# EAGLE schematic 20160901_MMPLATES (EAGLE 7.4.0)
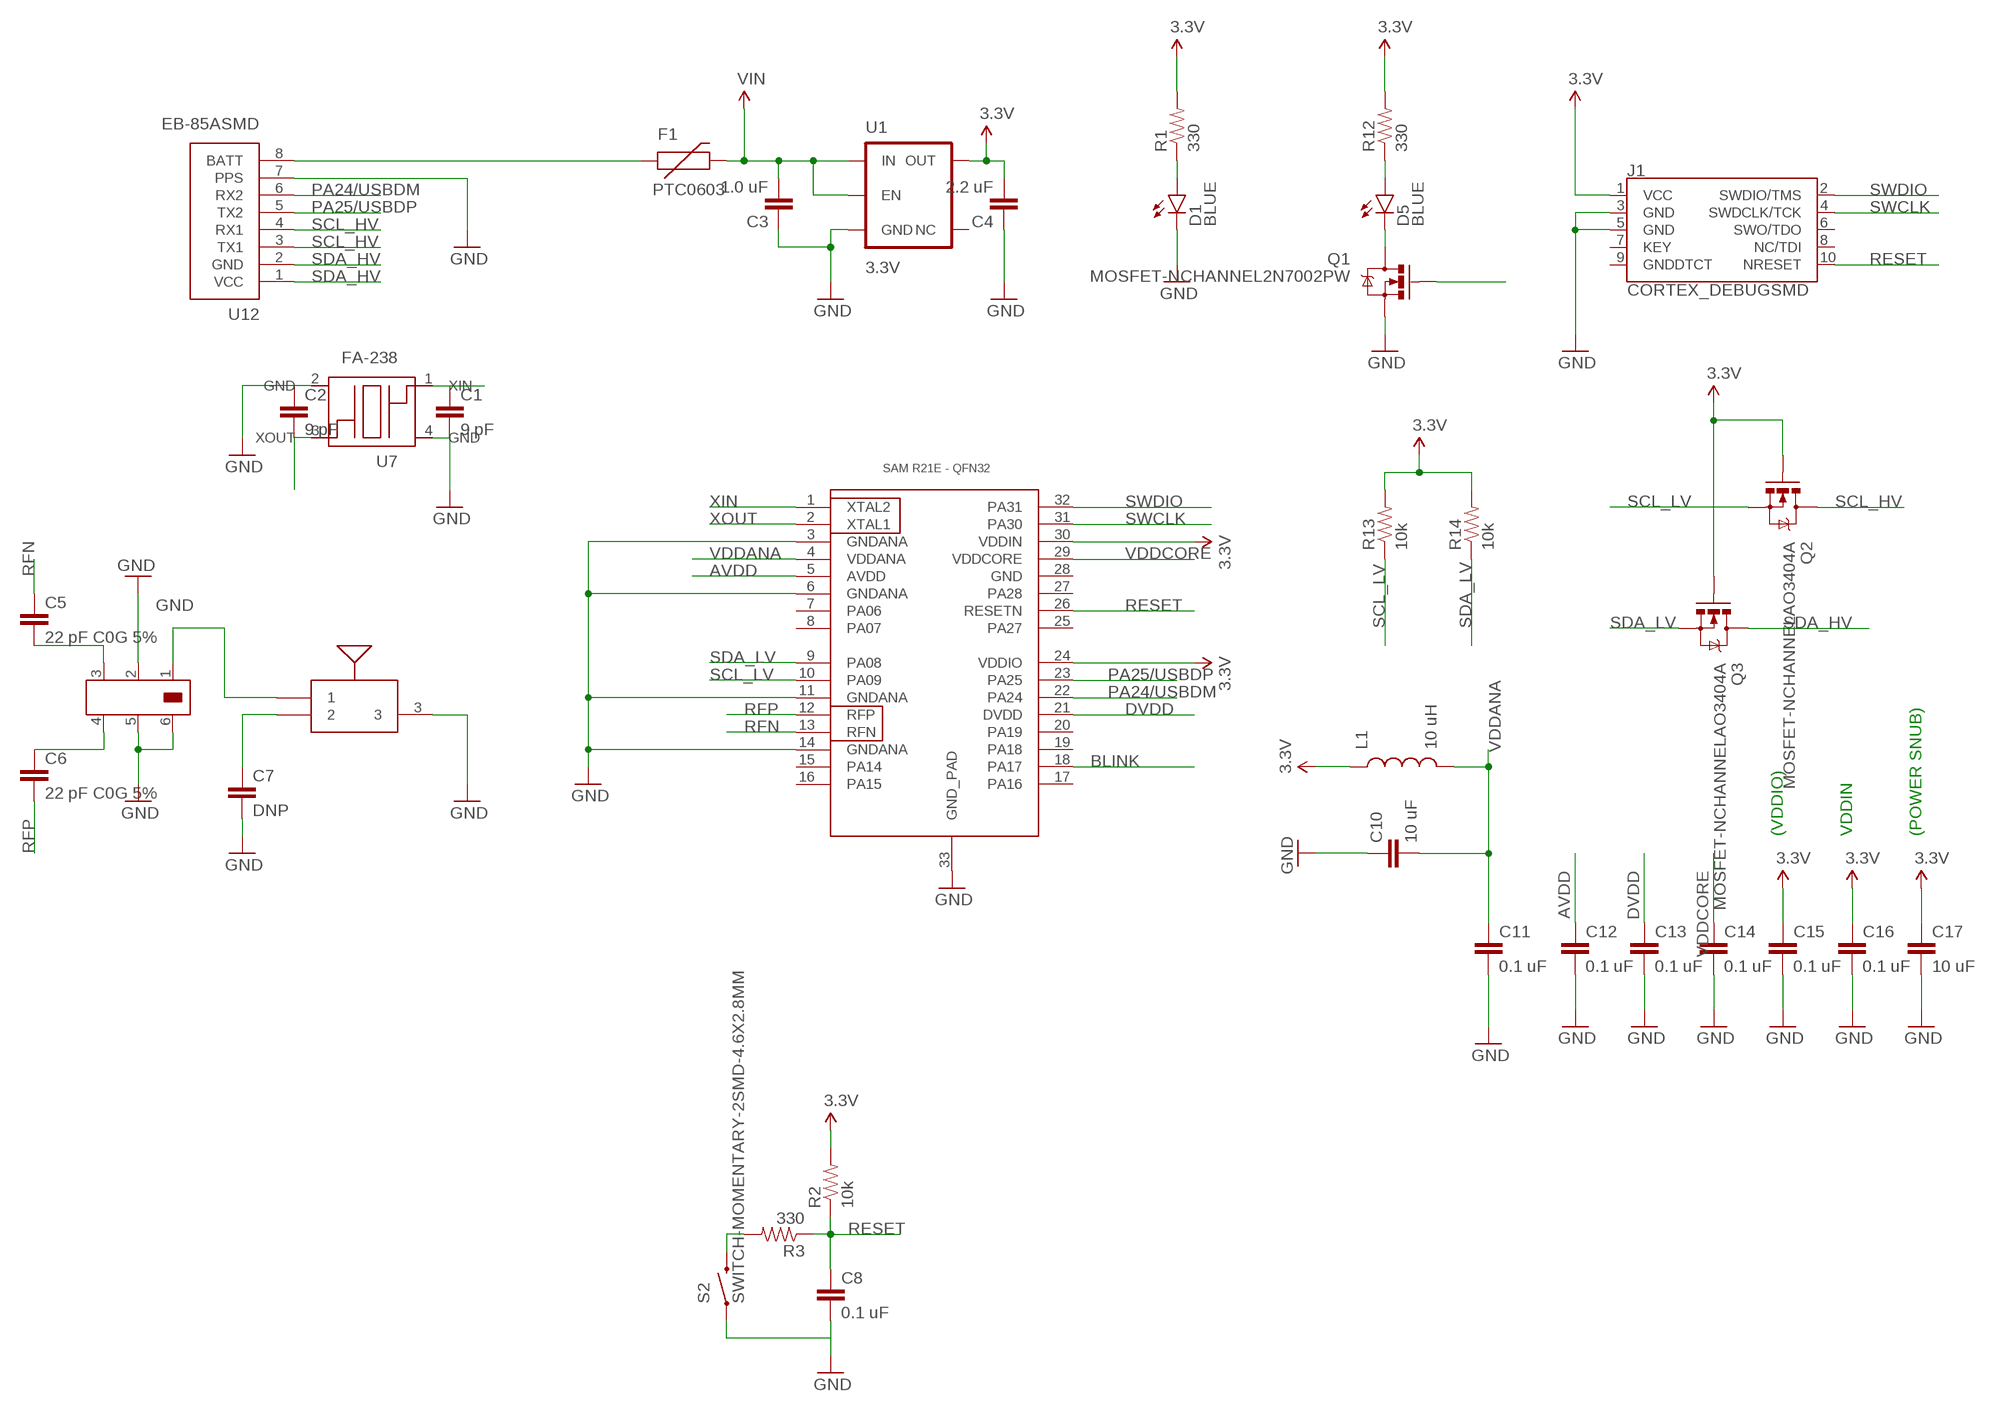
[diagram p0: schematic, sheet 1, part 1 of 2]
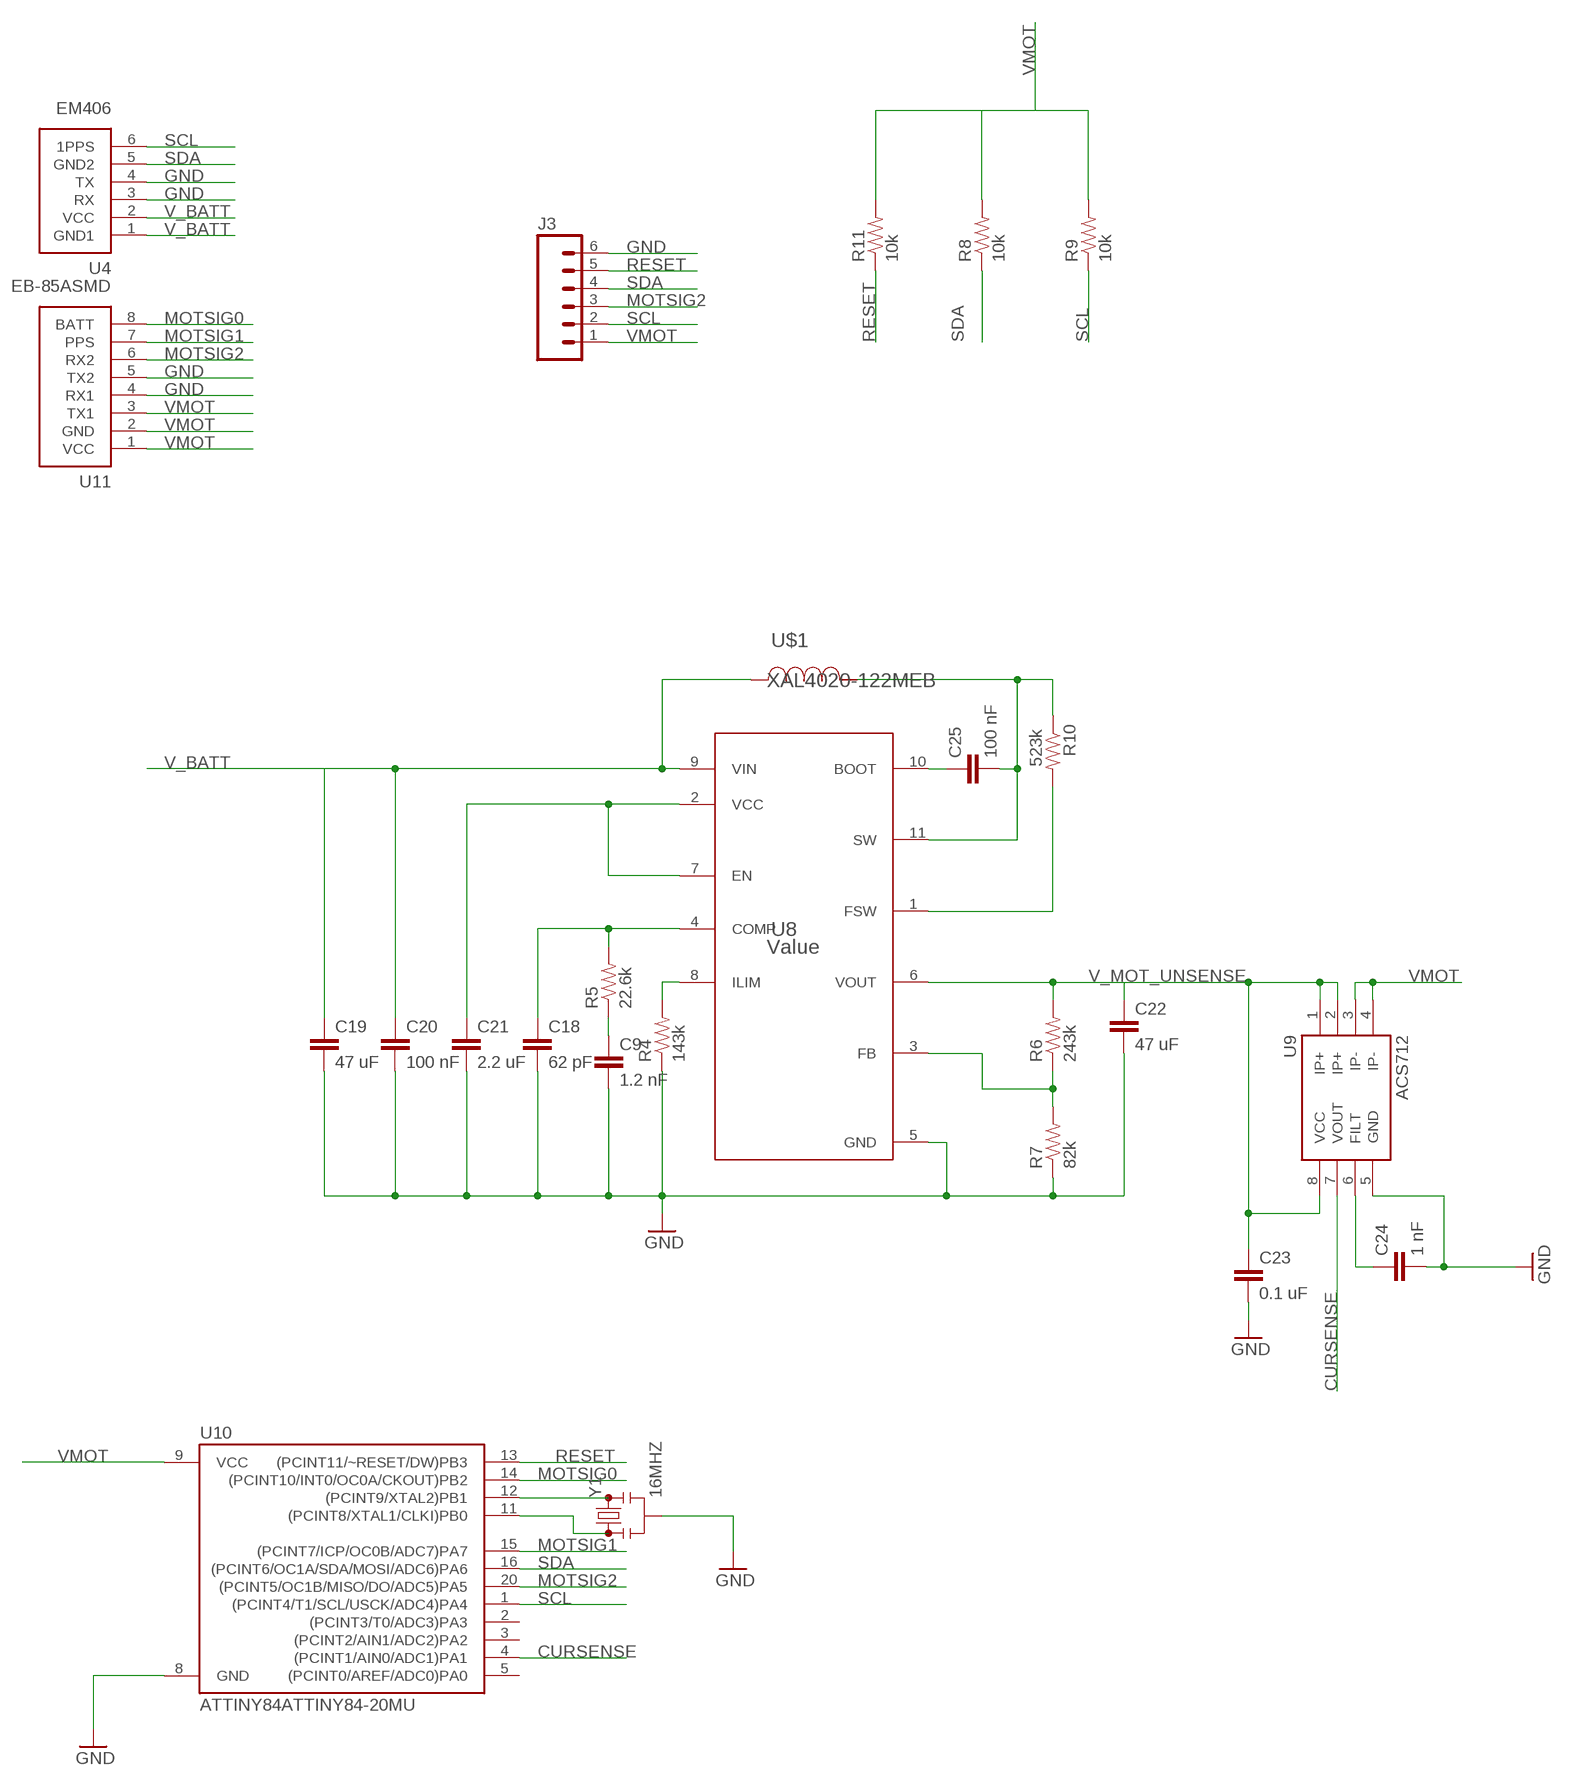
[diagram p1: schematic, sheet 1, part 2 of 2]

## Parts
C1  9 pF  CAP0402-CAP  [0402-CAP]
C2  9 pF  CAP0402-CAP  [0402-CAP]
C3  1.0 uF  CAP0402-CAP  [0402-CAP]
C4  2.2 uF  CAP0402-CAP  [0402-CAP]
C5  22 pF C0G 5%  CAP0402-CAP  [0402-CAP]
C6  22 pF C0G 5%  CAP0402-CAP  [0402-CAP]
C7  DNP  CAP0402-CAP  [0402-CAP]
C8  0.1 uF  CAP0402-CAP  [0402-CAP]
C9  1.2 nF  CAP0805  [0805]
C10  10 uF  CAP0402-CAP  [0402-CAP]
C11  0.1 uF  CAP0402-CAP  [0402-CAP]
C12  0.1 uF  CAP0402-CAP  [0402-CAP]
C13  0.1 uF  CAP0402-CAP  [0402-CAP]
C14  0.1 uF  CAP0402-CAP  [0402-CAP]
C15  0.1 uF  CAP0402-CAP  [0402-CAP]
C16  0.1 uF  CAP0402-CAP  [0402-CAP]
C17  10 uF  CAP0402-CAP  [0402-CAP]
C18  62 pF  CAP0805  [0805]
C19  47 uF  CAP1206  [1206]
C20  100 nF  CAP0402-CAP  [0402-CAP]
C21  2.2 uF  CAP0603-CAP  [0603-CAP]
C22  47 uF  CAP1206  [1206]
C23  0.1 uF  CAP0402-CAP  [0402-CAP]
C24  1 nF  CAP0402-CAP  [0402-CAP]
C25  100 nF  CAP0402-CAP  [0402-CAP]
D1  BLUE  LED-BLUE0603  [LED-0603]
D5  BLUE  LED-BLUE0603  [LED-0603]
F1  PTC0603  [0603]
J1  CORTEX_DEBUGSMD  [SAMTECH_FTSH-105-01]
J3  M06SMD-1MM  [1X06-1MM]
L1  10 uH  INDUCTOR0603  [0603]
Q1  MOSFET-NCHANNEL2N7002PW  [SOT323]
Q2  MOSFET-NCHANNELAO3404A  [SOT23-3]
Q3  MOSFET-NCHANNELAO3404A  [SOT23-3]
R1  330  RESISTOR0402-RES  [0402-RES]
R2  10k  RESISTOR0402-RES  [0402-RES]
R3  330  RESISTOR0402-RES  [0402-RES]
R4  143k  RESISTOR1206  [1206]
R5  22.6k  RESISTOR0402-RES  [0402-RES]
R6  243k  RESISTOR0402-RES  [0402-RES]
R7  82k  RESISTOR0603-RES  [0603-RES]
R8  10k  RESISTOR0402-RES  [0402-RES]
R9  10k  RESISTOR0402-RES  [0402-RES]
R10  523k  RESISTOR1206  [1206]
R11  10k  RESISTOR0402-RES  [0402-RES]
R12  330  RESISTOR0402-RES  [0402-RES]
R13  10k  RESISTOR0402-RES  [0402-RES]
R14  10k  RESISTOR0402-RES  [0402-RES]
S2  SWITCH-MOMENTARY-2SMD-4.6X2.8MM  [TACTILE_SWITCH_SMD_4.6X2.8MM]
U1  3.3V  V_REG_AP2112K-3.3V  [SOT23-5]
U2  ATSAMR21E18A-MUT  [QFN32]
U4  EM406  [EM406]
U5  PULSE_ANT_2.4GHZ  [ANT_BAR]
U6  JOHANSON_2450BM15A0015E  [0805_BALUN]
U7  FA-238  [FA-238]
U8  Value  TPS61089RNRR  [RNR0011A]
U9  ACS712  [SO08]
U10  ATTINY84ATTINY84-20MU  [QFN20]
U11  EB-85ASMD  [EB-85A]
U12  EB-85ASMD  [EB-85A]
U$1  XAL4020-122MEB  [XAL4020]
Y1  16MHZ  RESONATOR16MHZ  [RESONATOR-SMD]

## Nets
3.3V: C4.2 C15.1 C16.1 C17.1 J1.1(VCC) L1.1 Q2.1(G) Q3.1(G) R1.2 R2.2 R12.2 R13.2 R14.2 U1.5(OUT) U2.24(VDDIO) U2.30(VDDIN)
AVDD: C12.1 U2.5(AVDD)
BLINK: Q1.1(G) U2.18(PA17)
CURSENSE: U9.7(VOUT) U10.4((PCINT1/AIN0/ADC1)PA1)
DVDD: C13.1 U2.21(DVDD)
GND: C1.2 C2.1 C3.1 C4.1 C7.2 C8.2 C9.2 C10.1 C11.2 C12.2 C13.2 C14.2 C15.2 C16.2 C17.2 C18.2 C19.2 C20.2 C21.2 C22.2 C23.2 C24.2 D1.C J1.3(GND) J1.5(GND) J3.6 Q1.2(S) R4.1 R7.1 S2.1 S2.2 U1.2(GND) U2.3(GNDANA) U2.6(GNDANA) U2.11(GNDANA) U2.14(GNDANA) U2.33(GND_PAD) U4.3(RX) U4.4(TX) U5.3 U6.2 U6.5 U6.6 U7.2(GND) U7.4(GND) U8.5(GND) U9.5(GND) U10.8(GND) U11.4(RX1) U11.5(TX2) U12.7(PPS) Y1.2
MOTSIG0: U10.14((PCINT10/INT0/OC0A/CKOUT)PB2) U11.8(BATT)
MOTSIG1: U10.15((PCINT7/ICP/OC0B/ADC7)PA7) U11.7(PPS)
MOTSIG2: J3.3 U10.20((PCINT5/OC1B/MISO/DO/ADC5)PA5) U11.6(RX2)
N$1: F1.1 U12.8(BATT)
N$2: R3.2 S2.3 S2.4
N$3: R4.2 U8.8(ILIM)
N$4: U10.12((PCINT9/XTAL2)PB1) Y1.3
N$5: U10.11((PCINT8/XTAL1/CLKI)PB0) Y1.1
N$6: U5.1 U6.1
N$7: C7.1 U5.2
N$8: D1.A R1.1
N$10: C5.2 U6.3
N$11: C6.1 U6.4
N$14: C9.1 R5.1
N$15: C18.1 R5.2 U8.4(COMP)
N$16: C24.1 U9.6(FILT)
N$19: C21.1 U8.2(VCC) U8.7(EN)
N$20: D5.A R12.1
N$21: D5.C Q1.3(D)
N$27: C25.1 U8.10(BOOT)
N$28: C25.2 R10.1 U8.11(SW) U$1.2
N$29: R10.2 U8.1(FSW)
N$31: R6.1 R7.2 U8.3(FB)
PA24/USBDM: U2.22(PA24) U12.6(RX2)
PA25/USBDP: U2.23(PA25) U12.5(TX2)
RESET: C8.1 J1.10(NRESET) J3.5 R2.1 R3.1 R11.1 U2.26(RESETN) U10.13((PCINT11/~RESET/DW)PB3)
RFN: C5.1 U2.13(RFN)
RFP: C6.2 U2.12(RFP)
SCL: J3.2 R9.1 U4.6(1PPS) U10.1((PCINT4/T1/SCL/USCK/ADC4)PA4)
SCL_HV: Q2.3(D) U12.3(TX1) U12.4(RX1)
SCL_LV: Q2.2(S) R13.1 U2.10(PA09)
SDA: J3.4 R8.1 U4.5(GND2) U10.16((PCINT6/OC1A/SDA/MOSI/ADC6)PA6)
SDA_HV: Q3.3(D) U12.1(VCC) U12.2(GND)
SDA_LV: Q3.2(S) R14.1 U2.9(PA08)
SWCLK: J1.4(SWDCLK/TCK) U2.31(PA30)
SWDIO: J1.2(SWDIO/TMS) U2.32(PA31)
V_BATT: C19.1 C20.1 U4.1(GND1) U4.2(VCC) U8.9(VIN) U$1.1
V_MOT_UNSENSE: C22.1 C23.1 R6.2 U8.6(VOUT) U9.1(IP+) U9.2(IP+) U9.8(VCC)
VDDANA: C10.2 C11.1 L1.2 U2.4(VDDANA)
VDDCORE: C14.1 U2.29(VDDCORE)
VIN: C3.2 F1.2 U1.1(IN) U1.3(EN)
VMOT: J3.1 R8.2 R9.2 R11.2 U9.3(IP-) U9.4(IP-) U10.9(VCC) U11.1(VCC) U11.2(GND) U11.3(TX1)
XIN: C1.1 U2.1(XTAL2) U7.1(XIN)
XOUT: C2.2 U2.2(XTAL1) U7.3(XOUT)
Unconnected: J1.6(SWO/TDO) J1.7(KEY) J1.8(NC/TDI) J1.9(GNDDTCT) U1.4(NC) U2.7(PA06) U2.8(PA07) U2.15(PA14) U2.16(PA15) U2.17(PA16) U2.19(PA18) U2.20(PA19) U2.25(PA27) U2.27(PA28) U2.28(GND) U10.2((PCINT3/T0/ADC3)PA3) U10.3((PCINT2/AIN1/ADC2)PA2) U10.5((PCINT0/AREF/ADC0)PA0)

## Notes on the sheet
- (VDDIO) | VDDIN | (POWER SNUB)

## Library data of the parts
C1-C25 = SparkFun-Passives:CAP: Capacitor Standard 0603 ceramic capacitor, and 0.1" leaded capacitor.
D1 D5 = SparkFun-LED:LED-BLUE: Blue LEDs for production use Various blue LEDs stocked by SparkFun production 0603 - DIO-08575 Rebel - DIO-09553 1206 - DIO-09911; PROD_ID: DIO-08575
F1 = SparkFun-PowerIC:PTC: Resettable Fuse PTC Resettable Fuse. Spark Fun Electronics SKU : COM-08357
J1 = SparkFun-Connectors:CORTEX_DEBUG: Cortex Debug Connector Datasheet <http://infocenter.arm.com/help/topic/com.arm.doc.faqs/attached/13634/cortex_debug_connectors.pdf>
J3 = CSL_Components:M06: Header 6 Standard 6-pin 0.1" header. Use with straight break away headers (SKU : PRT-00116), right angle break away headers (PRT-00553), swiss pins (PRT-00743), machine pins (PRT-00117), and female headers (PRT-00115). Molex polarized connector foot print use with SKU : PRT-08094 with associated crimp pins and housings. NOTES ON THE VARIANTS LOCK and LOCK_LONGPADS... This footprint was designed to help hold the alignment of a through-hole component (i.e. 6-pin header) while soldering it into place. You may notice that each hole has been shifted either up or down by 0.005 of an inch from it's more standard position (which is a perfectly straight line). This slight alteration caused the pins (the squares in the middle) to touch the edges of the holes. Because they are alternating, it causes a "brace" to hold the component in place. 0.005 has proven to be the perfect amount of "off-center" position when using our standard breakaway headers. Although looks a little odd when you look at the bare footprint, once you have a header in there, the alteration is very hard to notice. Also,if you push a header all the way into place, it is covered up entirely on the bottom side. This idea of altering the position of holes to aid alignment will be further integrated into the Sparkfun Library for other footprints. It can help hold any component with 3 or more connection pins.
L1 = SparkFun-Passives:INDUCTOR: Inductors Basic Inductor/Choke - 0603 and 1206. Footprints are not proven and vary greatly between part numbers. INDUCTOR POWER 3.3UH 4.0A SMD 0.197" L x 0.197" W x 0.177" H (5.00mm x 5.00mm x 4.50mm)
Q1 = SparkFun-DiscreteSemi:MOSFET-NCHANNEL: Common NMOSFET Parts MFG P/N Store ID Prod ID FDD8780 TRANS-09984 SI7820DN TRANS-11055 FDS6630A IC-08089 2N7002PW TRANS-11151 FQP30N06L COM-10213 TRANS-10060 BSS123LT1G TRANS-08345 BSS138 TRANS-00830 BS170 2N7000; PROD_ID: TRANS-11151
Q2 Q3 = SparkFun-DiscreteSemi:MOSFET-NCHANNEL: Common NMOSFET Parts MFG P/N Store ID Prod ID FDD8780 TRANS-09984 SI7820DN TRANS-11055 FDS6630A IC-08089 2N7002PW TRANS-11151 FQP30N06L COM-10213 TRANS-10060 BSS123LT1G TRANS-08345 BSS138 TRANS-00830 BS170 2N7000; PROD_ID: TRAN-12988
R1-R3 R5-R9 R11-R14 = SparkFun-Passives:RESISTOR: Resistor Basic schematic elements and footprints for 0603, 1206, and PTH resistors.
R4 R10 = SparkFun-Resistors:RESISTOR: Resistor Basic schematic elements and footprints for 0603, 1206, and PTH resistors.
S2 = SparkFun-Electromechanical:SWITCH-MOMENTARY-2: Various NO switches- pushbuttons, reed, etc; PROD_ID: SWCH-13065
U1 = SparkFun-PowerIC:V_REG_AP2112: AP2112 - 600mA CMOS LDO Regulator w/ Enable The AP2112 is CMOS process low dropout linear regulator with enable function, the regulator delivers a guaranteed 600mA (min.) continuous load current. Features Output Voltage Accuracy: ±1.5% Output Current: 600mA (Min.) Foldback Short Current Protection: 50mA Enable Function to Turn ON/OFF VOUT Low Dropout Voltage (3.3V): 250mV (Typ.) @IOUT=600mA Excellent Load Regulation: 0.2%/A (Typ.) Excellent Line Regulation: 0.02%/V (Typ.) Low Quiescent Current: 55μA (Typ.) Low Standby Current: 0.01μA (Typ.) Low Output Noise: 50μVRMS PSRR: 100Hz -65dB, 1kHz -65dB OTSD Protection Stable with 1.0μF Flexible Cap: Ceramic, Tantalum and Aluminum Electrolytic Operation Temperature Range: -40°C to 85°C ESD: MM 400V, HBM 4000V; PROD_ID: VREG-12457
U2 = atmel-samr21:ATSAMR21E18A-MUT: This is the ATMEL SAMR21E QFN-32. ATSAMR21E18A
U4 = SparkFun-Connectors:EM406: EM406 GPS Connector Proven layout and schematic for EM406 connector. Spark Fun Electronics SKU : GPS-00579
U5 = bar_antenna:PULSE_ANT_2.4GHZ: Manufacturer part #W3008
U6 = balun:JOHANSON_2450BM15A0015E
U7 = crystals:FA-238
U8 = TPS61089RNRR_4.8V:TPS61089RNRR; MANUFACTURER: Texas Instruments; MANUFACTURER_NAME: Texas Instruments; MANUFACTURER_PART_NUMBER: TPS61089RNRR; PARTNUMBER: TPS61089RNRR; REFDES: RefDes; TYPE: TYPE
U9 = SparkFun-AnalogIC:ACS712: Hall-effect-based isolated linear current sensor; PROD_ID: IC-08964
U10 = SparkFun-DigitalIC:ATTINY84: Atmel 14-pin 2/4/8kB flash uC
U11 U12 = SparkFun-Connectors:EB-85A: EB-85A Connector Proven layout and schematic for ETek 5Hz GPS receiver connector. Spark Fun Electronics SKU : GPS-08297
U$1 = TPS61089RNRR_4.8V:XAL4020-122MEB
Y1 = SparkFun-FreqCtrl:RESONATOR: Resonator Small SMD resonator. Used, eg, on the Arduino Pro/ Pro Mini boards. 8MHz- XTAL-08895 16MHz- XTAL-08900; PROD_ID: XTAL-08900